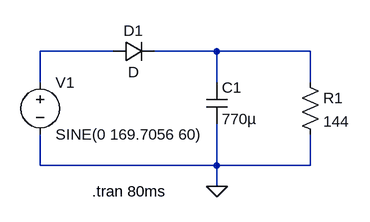
[diagram p0: schematic 1diode-120VAC-60Hz-770uF-144Ohm.asc]
1diode-120VAC-60Hz-770uF-144Ohm.asc, the LTspice schematic file:
Version 4
SHEET 1 880 680
WIRE 144 112 32 112
WIRE 304 112 208 112
WIRE 448 112 304 112
WIRE 32 160 32 112
WIRE 304 160 304 112
WIRE 448 160 448 112
WIRE 32 288 32 240
WIRE 304 288 304 224
WIRE 304 288 32 288
WIRE 448 288 448 240
WIRE 448 288 304 288
WIRE 304 320 304 288
FLAG 304 320 0
SYMBOL cap 288 160 R0
SYMATTR InstName C1
SYMATTR Value 770µ
SYMBOL res 432 144 R0
SYMATTR InstName R1
SYMATTR Value 144
SYMBOL diode 144 128 R270
WINDOW 0 32 32 VTop 2
WINDOW 3 0 32 VBottom 2
SYMATTR InstName D1
SYMBOL voltage 32 144 R0
WINDOW 123 24 124 Left 2
WINDOW 39 0 0 Left 2
SYMATTR InstName V1
SYMATTR Value SINE(0 169.7056 60)
TEXT 112 328 Left 2 !.tran 80ms

The netlist it stands for:
* 1diode-120VAC-60Hz-770uF-144Ohm.asc
C1 N002 0 770µ
R1 N002 0 144
D1 N001 N002 D
V1 N001 0 SINE(0 169.7056 60)
.model D D
.lib standard.dio
.tran 80ms
.backanno
.end